# Altium schematic sheet 0190_TOUCH PAD CONNECTO.SchDoc
size 848 x 558 mm
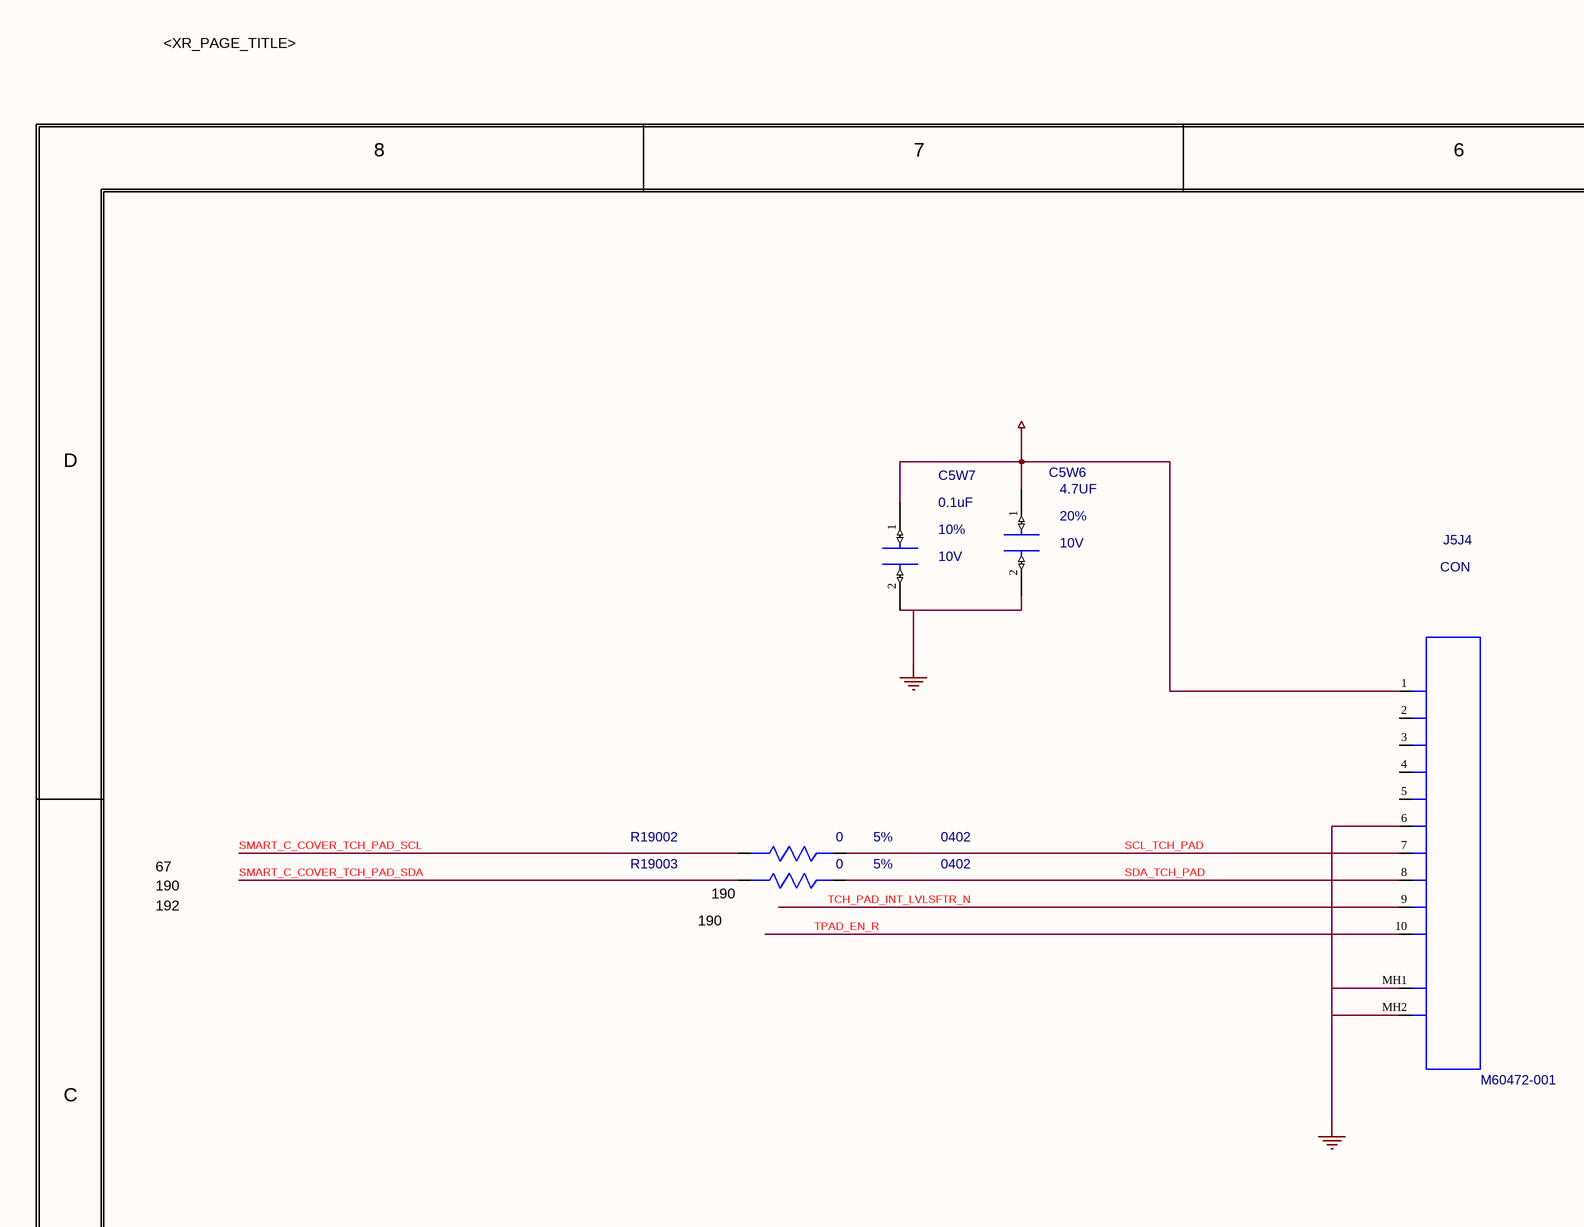
[diagram p0: 0190_TOUCH PAD CONNECTO.SchDoc, top left]
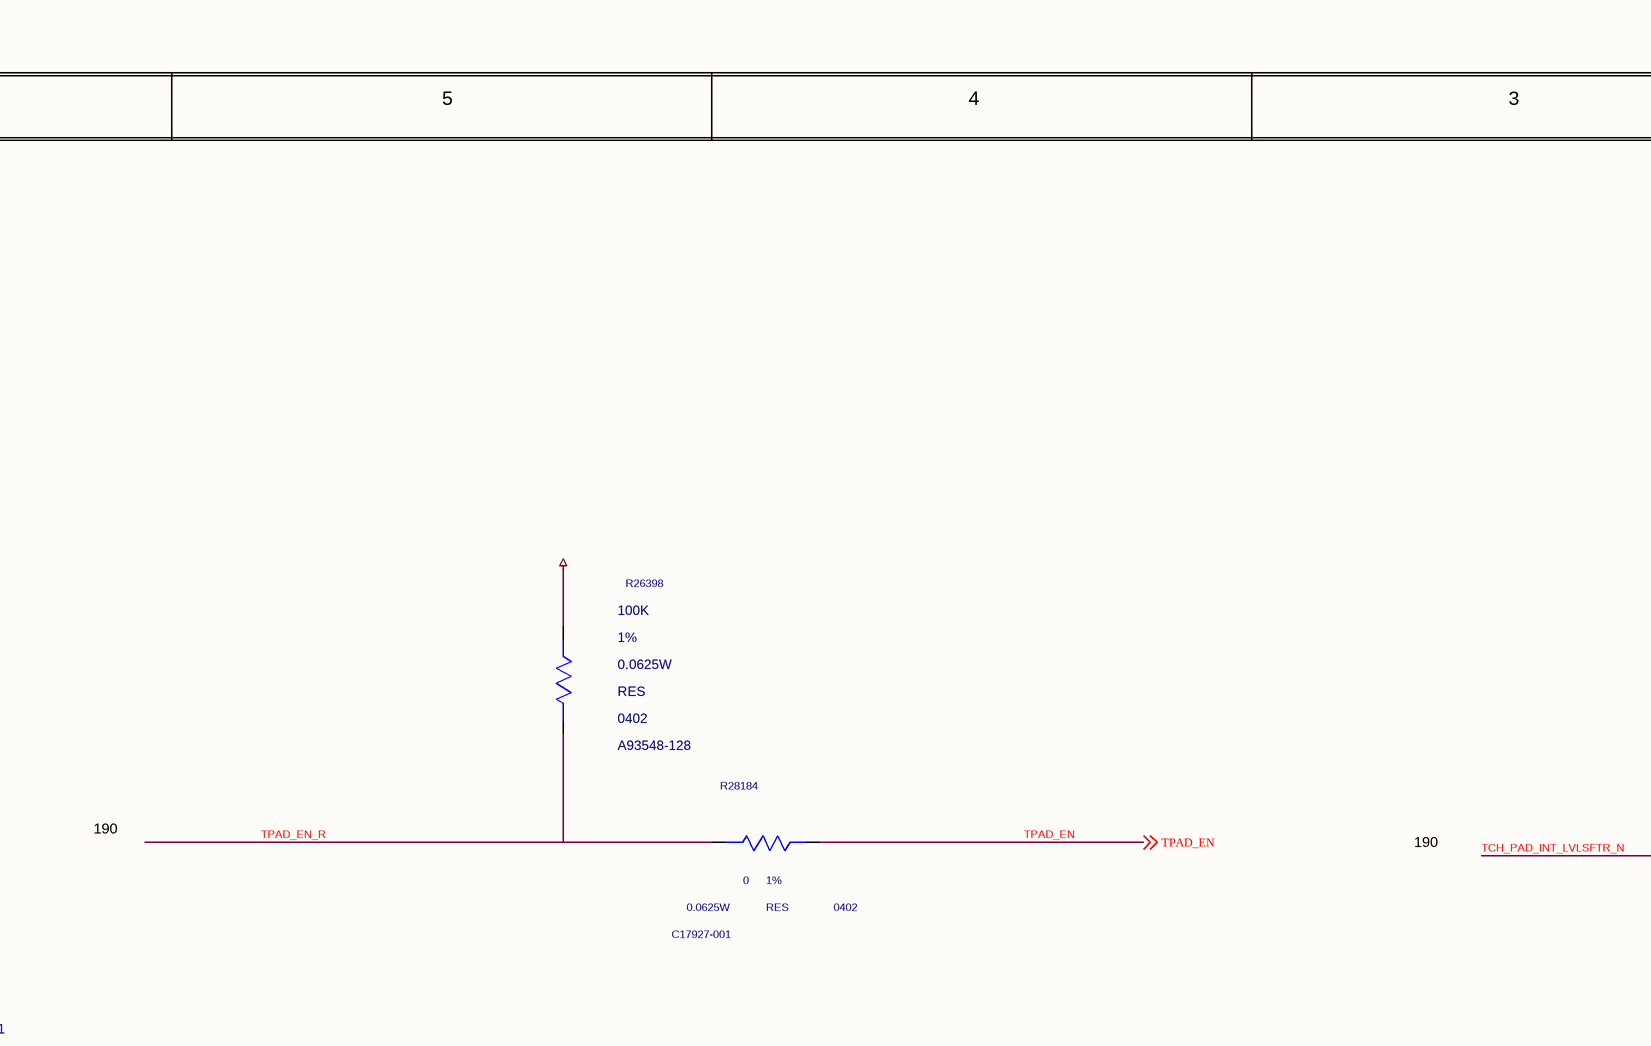
[diagram p1: 0190_TOUCH PAD CONNECTO.SchDoc, top middle]
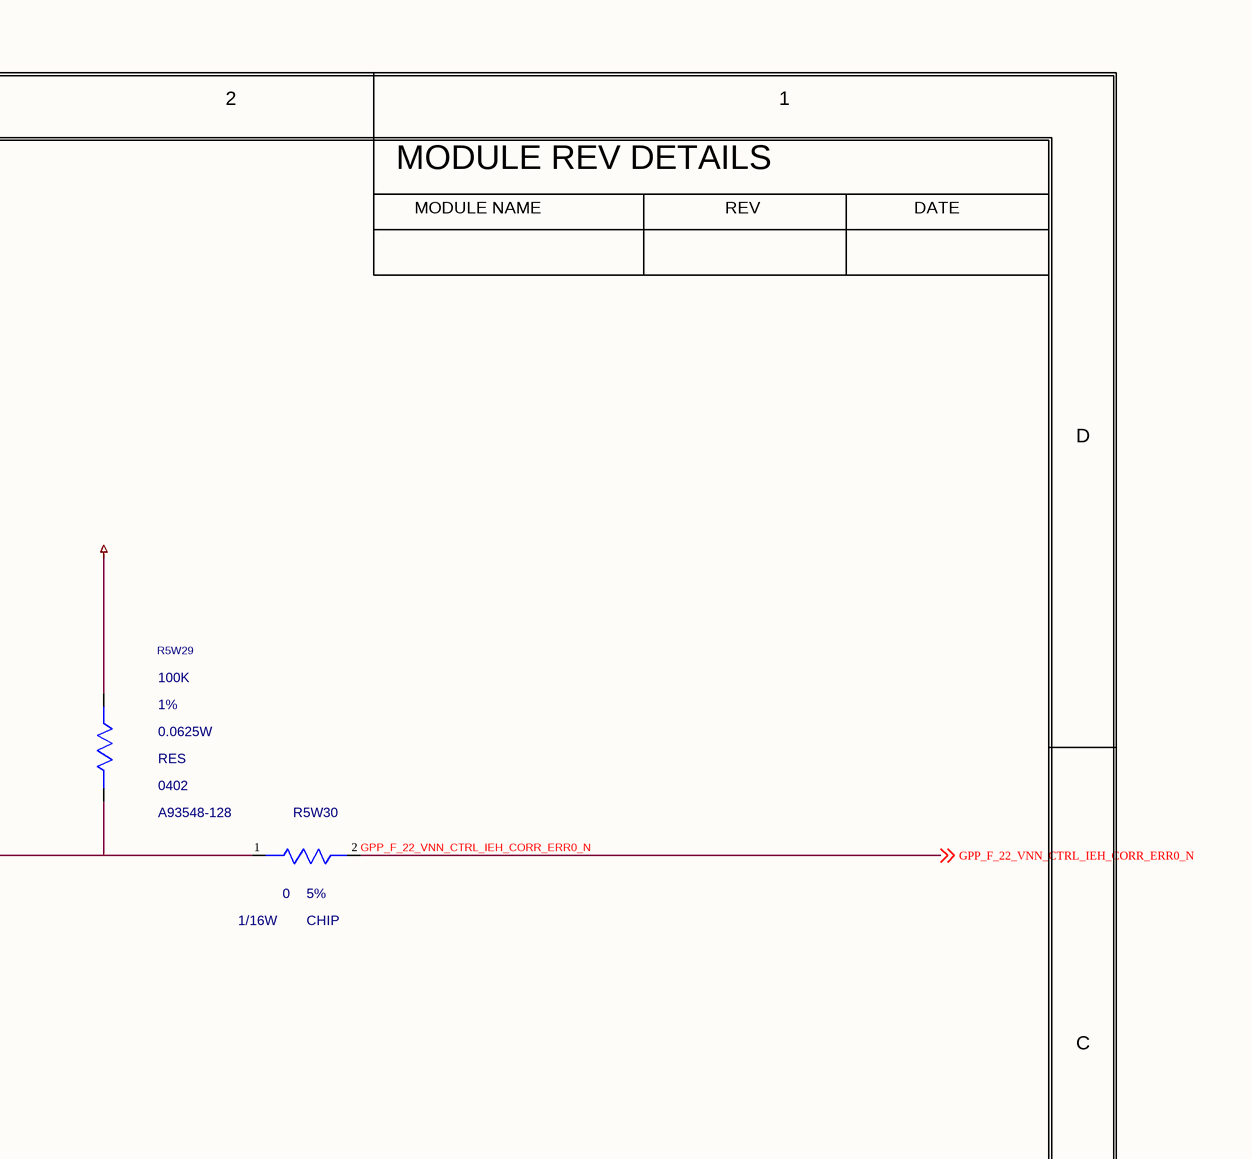
[diagram p2: 0190_TOUCH PAD CONNECTO.SchDoc, top right]
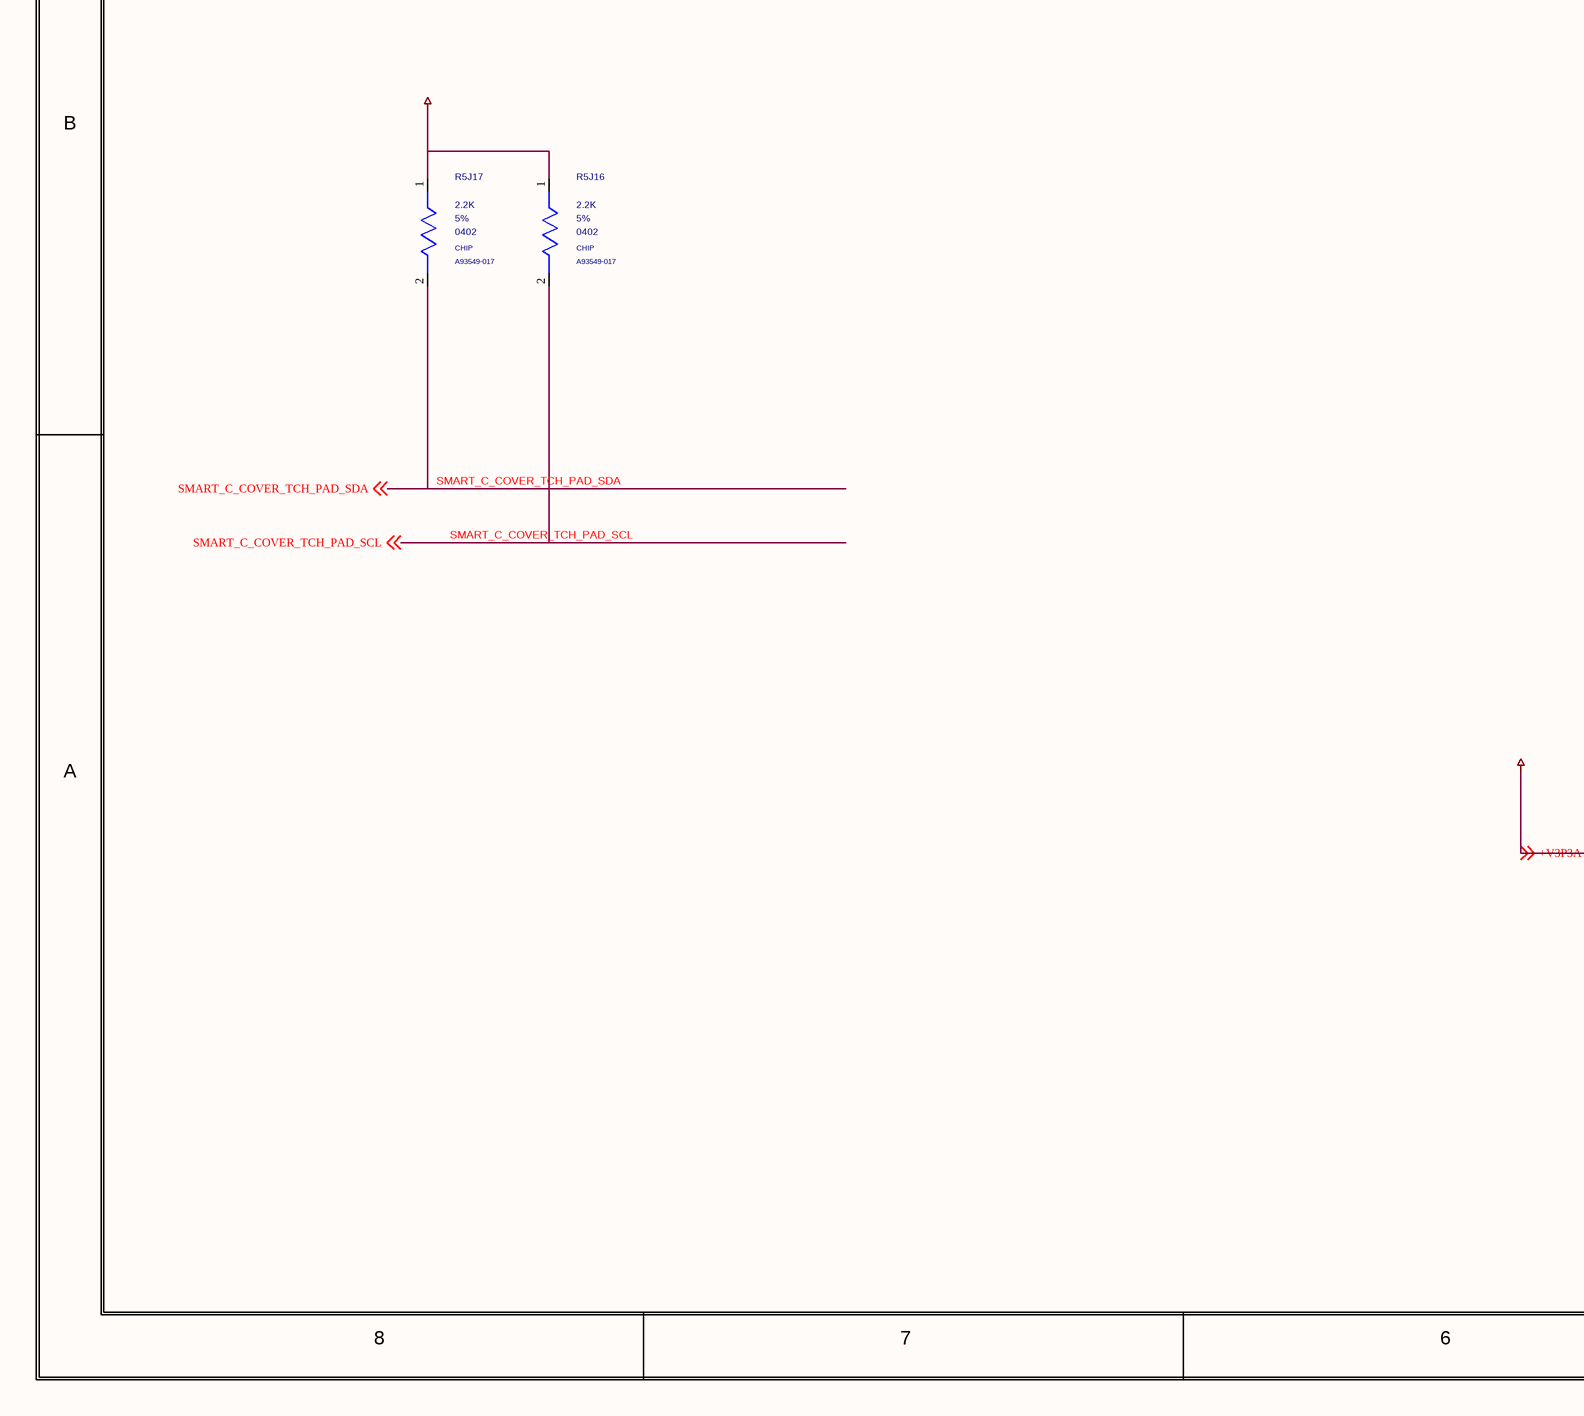
[diagram p3: 0190_TOUCH PAD CONNECTO.SchDoc, bottom left]
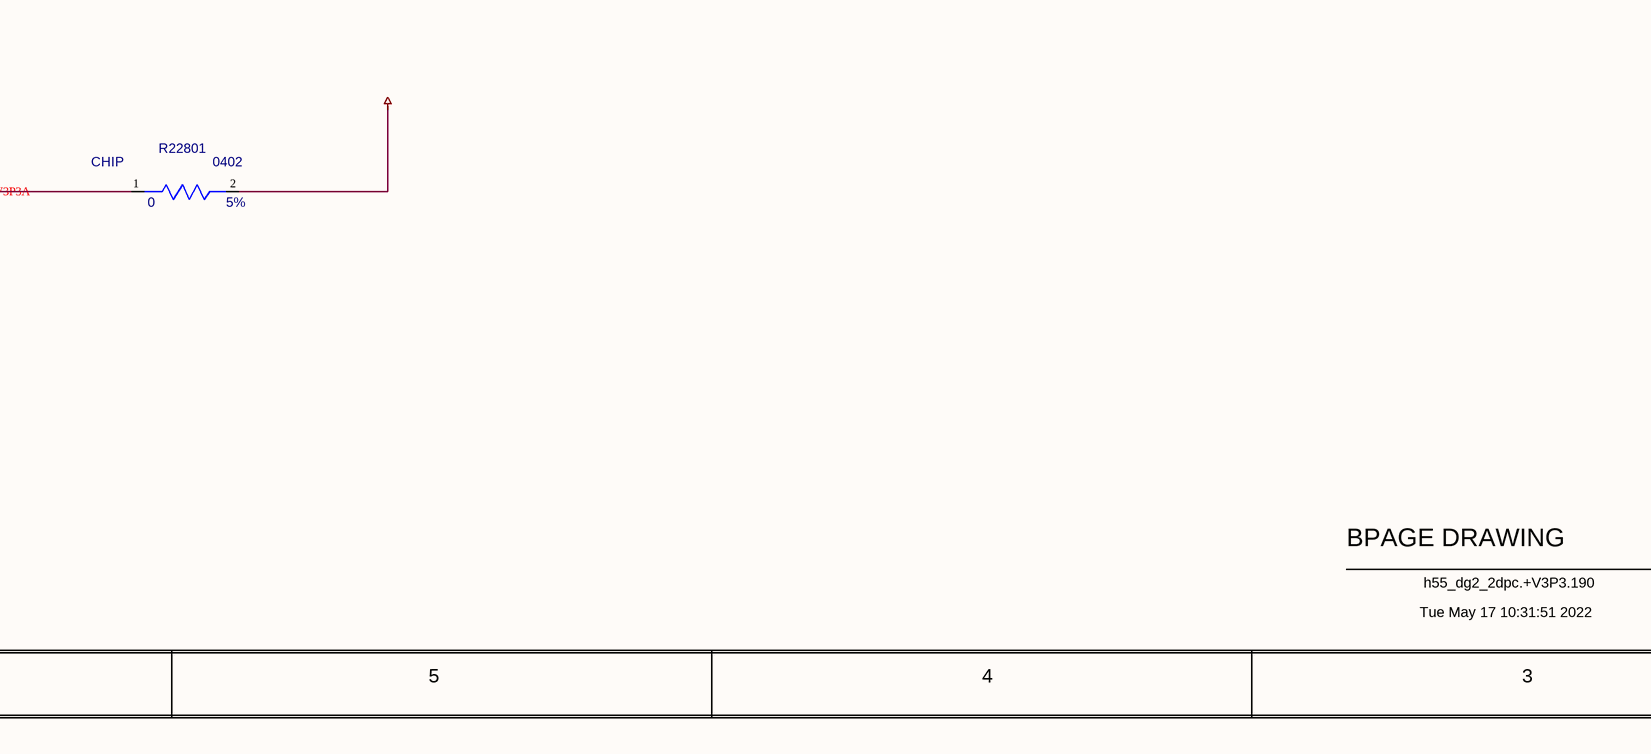
[diagram p4: 0190_TOUCH PAD CONNECTO.SchDoc, bottom middle]
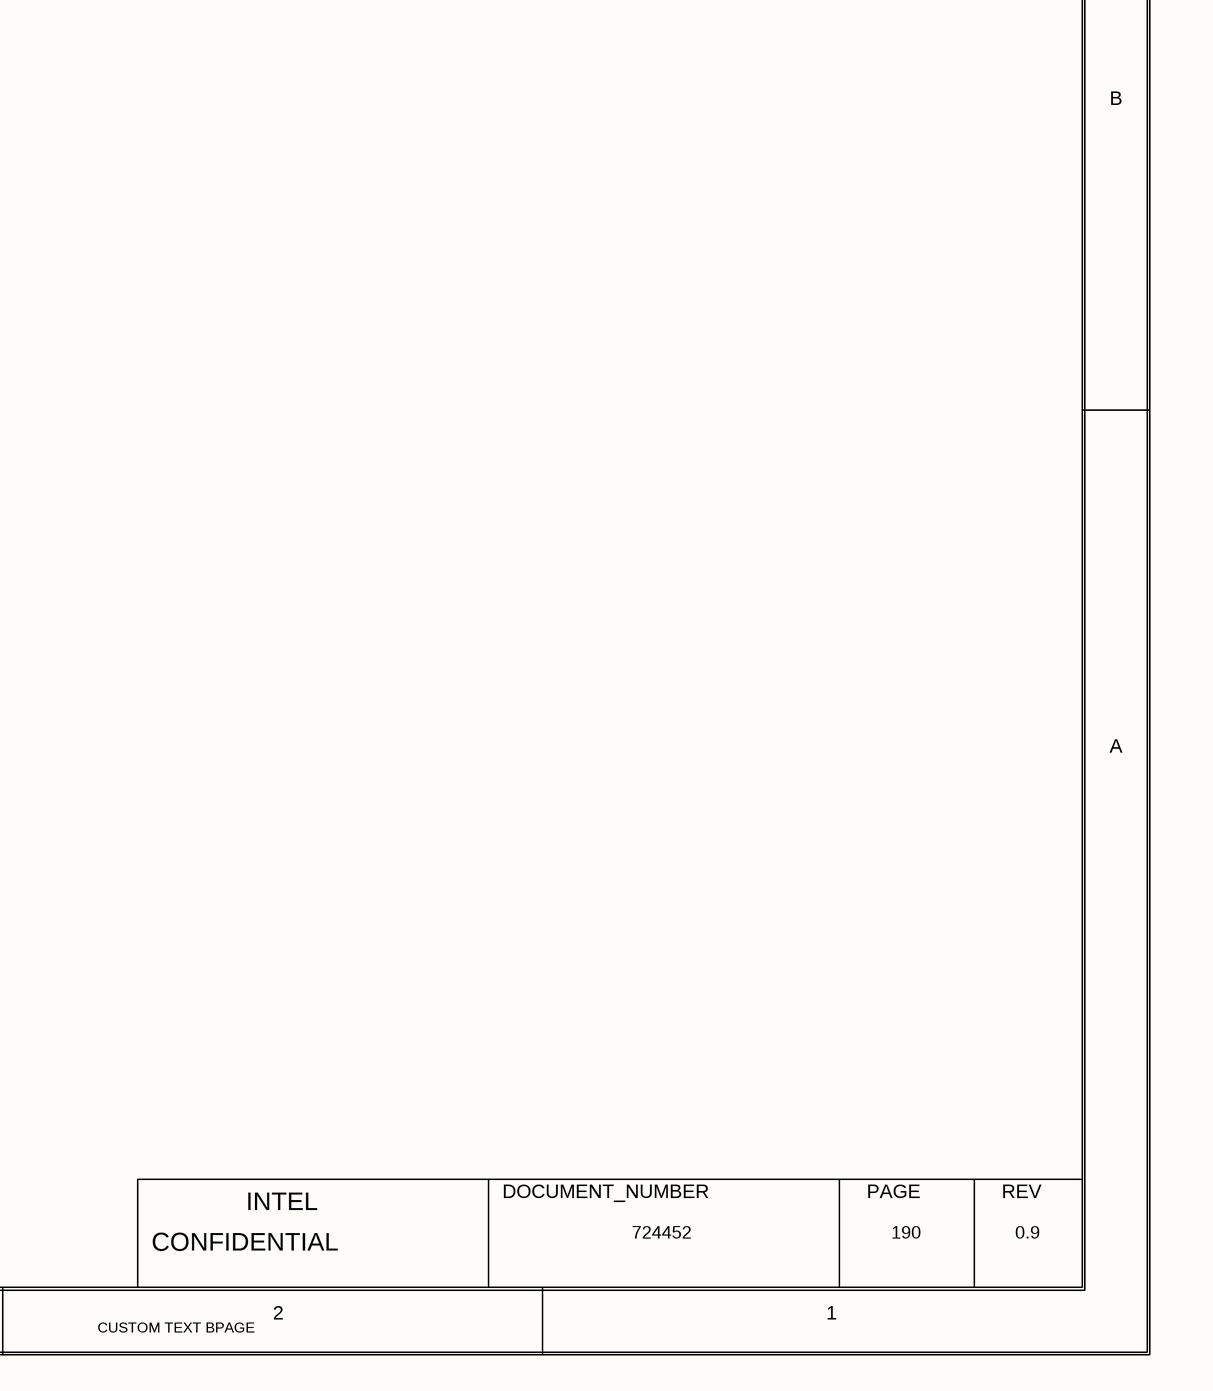
[diagram p5: 0190_TOUCH PAD CONNECTO.SchDoc, bottom right]

## Parts
C5W6  4.7UF  TOLERANCE: 20%  VOLTAGE: 10V  [SMC0402IA]
C5W7  0.1uF  TOLERANCE: 10%  VOLTAGE: 10V  [SMC0402IA]
J5J4  MATERIAL: CON  PART_NUMBER: M60472-001  [CTK0_B2B_SJR_1X10_2EM_500_MD_VR]  (hidden comment: C_B2B_1X10_2EM)
R5J16  2.2K  MATERIAL: CHIP  PACK_TYPE: 0402  PART_NUMBER: A93549-017  TOLERANCE: 5%  [SMR0402IA]
R5J17  2.2K  MATERIAL: CHIP  PACK_TYPE: 0402  PART_NUMBER: A93549-017  TOLERANCE: 5%  [SMR0402IA]
R5W29  100K  MATERIAL: RES  PACK_TYPE: 0402  PART_NUMBER: A93548-128  TOLERANCE: 1%  WATTAGE: 0.0625W  [CTK0_SM0402_1100X550_MA]
R5W30  0  MATERIAL: CHIP  TOLERANCE: 5%  WATTAGE: 1/16W  [SMR0402IA]
R19002  0  PACK_TYPE: 0402  TOLERANCE: 5%  [CTK2_SM0402_1100X550_MA]
R19003  0  PACK_TYPE: 0402  TOLERANCE: 5%  [CTK2_SM0402_1100X550_MA]
R22801  0  MATERIAL: CHIP  PACK_TYPE: 0402  TOLERANCE: 5%  [SMR0402IA]
R26398  100K  MATERIAL: RES  PACK_TYPE: 0402  PART_NUMBER: A93548-128  TOLERANCE: 1%  WATTAGE: 0.0625W  [CTK0_SM0402_1100X550_MA]
R28184  0  MATERIAL: RES  PACK_TYPE: 0402  PART_NUMBER: C17927-001  TOLERANCE: 1%  WATTAGE: 0.0625W  [CTK0_SM0402_1100X550_MA]

## Nets
+V3P3A: R22801.1(A) ; off-sheet +V3P3A
+V3P3A_CLICK_PAD: C5W6.1(A) C5W7.1(A) J5J4.1(IO1) R5J16.1(A) R5J17.1(A) R5W29.1(A) R22801.2(B) R26398.1(A)
GND: C5W6.2(B) C5W7.2(B) J5J4.6(IO6) J5J4.MH1 J5J4.MH2
GPP_F_22_VNN_CTRL_IEH_CORR_ERR0_N: R5W30.2(B) ; off-sheet GPP_F_22_VNN_CTRL_IEH_CORR_ERR0_N
SCL_TCH_PAD: J5J4.7(IO7) R19002.2(B)
SDA_TCH_PAD: J5J4.8(IO8) R19003.2(B)
SMART_C_COVER_TCH_PAD_SCL: R5J16.2(B) R19002.1(A) ; off-sheet SMART_C_COVER_TCH_PAD_SCL
SMART_C_COVER_TCH_PAD_SDA: R5J17.2(B) R19003.1(A) ; off-sheet SMART_C_COVER_TCH_PAD_SDA
TCH_PAD_INT_LVLSFTR_N: J5J4.9(IO9) R5W29.2(B) R5W30.1(A)
TPAD_EN: R28184.2(B) ; off-sheet TPAD_EN
TPAD_EN_R: J5J4.10(IO10) R26398.2(B) R28184.1(A)

Not connected (* = marked no-connect by the designer): J5J4 2(IO2) 3(IO3) 4(IO4) 5(IO5)

## Notes on the sheet
- <XR_PAGE_TITLE>
- 8
- 7
- 6
- 5
- 4
- 3
- 2
- 1
- MODULE REV DETAILS
- MODULE NAME
- REV
- DATE
- D
- 67
- 190
- 192
- (near R19003) 190
- C
- B
- A
- BPAGE DRAWING
- INTEL
- DOCUMENT_NUMBER
- PAGE
- Tue May 17 10:31:51 2022
- h55_dg2_2dpc.+V3P3.190
- CONFIDENTIAL
- 724452
- 0.9
- CUSTOM TEXT BPAGE

## Library data of the parts
C5W6 = CAP: PART_NUMBER: A36096-134; CDS_PHYS_PART_NAME: CAP_0402-A36096-134,X5R,4.7UF,10V,20%,LPDB,GENERIC; MATERIAL: X5R; PACK_TYPE: 0402; OriginalSymbolOrigin: (-50,25); XY: (-5275,4450); VER: 1; ROT: 0; PHYS_PAGE: 190; LOCATION: C5W6; IP: GENERIC; FP_TECH: LPDB; DRAWING: @RVP1_ADL_SB_ADP_S_DDR5_SODIMM_2DPC_LIB.H55_DG2_2DPC(SCH_1):PAGE559; CDS_LIB: discrete; PCB Footprint: SMC0402IA; CHIPS_PART_NAME: CAP; CDS_PART_NAME: CAP_0402-A36096-134,X5R,4.7UF,10V,20%,LPDB,GENERIC; CDS_LOCATION: C5W6
C5W7 = CAP: PART_NUMBER: A36096-043; CDS_PHYS_PART_NAME: CAP_0402-A36096-043,X5R,0.1UF,10V,10%,LPDB,GENERIC; MATERIAL: X5R; PACK_TYPE: 0402; OriginalSymbolOrigin: (-50,25); XY: (-5500,4425); VER: 1; ROT: 0; PHYS_PAGE: 190; LOCATION: C5W7; IP: GENERIC; FP_TECH: LPDB; DRAWING: @RVP1_ADL_SB_ADP_S_DDR5_SODIMM_2DPC_LIB.H55_DG2_2DPC(SCH_1):PAGE559; CDS_LIB: discrete; PCB Footprint: SMC0402IA; CHIPS_PART_NAME: CAP; CDS_PART_NAME: CAP_0402-A36096-043,X5R,0.1UF,10V,10%,LPDB,GENERIC; CDS_LOCATION: C5W7
J5J4 = C_B2B_1X10_2EM: CDS_PHYS_PART_NAME: C_B2B_1X10_2EM_SM-M60472-001,CON,B2B_1X10_2EM,TK0,GENERIC; CDS_LMAN_SYM_OUTLINE: -50,400,50,-400; FP_TECH: TK0; IP: GENERIC; PACK_TYPE: SM; ROOM: NONE; OriginalSymbolOrigin: (-50,400); XY: (-4475,3875); VER: 1; ROT: 2; PHYS_PAGE: 190; LOCATION: J5J4; DRAWING: @RVP1_ADL_SB_ADP_S_DDR5_SODIMM_2DPC_LIB.H55_DG2_2DPC(SCH_1):PAGE559; CDS_LIB: local; VARIANT: ?; PCB Footprint: CTK0_B2B_SJR_1X10_2EM_500_MD_VR; SEC_TYPE: SM; CHIPS_PART_NAME: C_B2B_1X10_2EM; CDS_PART_NAME: C_B2B_1X10_2EM_SM-M60472-001,CON,B2B_1X10_2EM,TK0,GENERIC; CDS_LOCATION: J5J4
R5J16 = RES: CDS_PHYS_PART_NAME: RES_0402-A93549-017,CHIP,2.2K,5%,1/16W,LPDB,GENERIC; WATTAGE: 1/16W; OriginalSymbolOrigin: (-25,75); XY: (-6150,2100); VER: 2; ROT: 0; PHYS_PAGE: 190; LOCATION: R5J16; IP: GENERIC; FP_TECH: LPDB; FIN: PCH; DRAWING: @RVP1_ADL_SB_ADP_S_DDR5_SODIMM_2DPC_LIB.H55_DG2_2DPC(SCH_1):PAGE559; CDS_LIB: discrete; PCB Footprint: SMR0402IA; CHIPS_PART_NAME: RES; CDS_PART_NAME: RES_0402-A93549-017,CHIP,2.2K,5%,1/16W,LPDB,GENERIC; CDS_LOCATION: R5J16; ASI_MODEL: A93549-017
R5J17 = RES: CDS_PHYS_PART_NAME: RES_0402-A93549-017,CHIP,2.2K,5%,1/16W,LPDB,GENERIC; WATTAGE: 1/16W; OriginalSymbolOrigin: (-25,75); XY: (-6375,2100); VER: 2; ROT: 0; PHYS_PAGE: 190; LOCATION: R5J17; IP: GENERIC; FP_TECH: LPDB; FIN: PCH; DRAWING: @RVP1_ADL_SB_ADP_S_DDR5_SODIMM_2DPC_LIB.H55_DG2_2DPC(SCH_1):PAGE559; CDS_LIB: discrete; PCB Footprint: SMR0402IA; CHIPS_PART_NAME: RES; CDS_PART_NAME: RES_0402-A93549-017,CHIP,2.2K,5%,1/16W,LPDB,GENERIC; CDS_LOCATION: R5J17; ASI_MODEL: A93549-017
R5W29 = C_RES: CDS_PHYS_PART_NAME: C_RES_0402-A93548-128,RES,100K,1%,0.0625W,TK0,GENERIC; CDS_LMAN_SYM_OUTLINE: -50,50,50,-50; FP_TECH: TK0; IP: GENERIC; ROOM: NONE; OriginalSymbolOrigin: (-25,75); XY: (-725,3975); VER: 2; SUB_ROOM_2: PUPD; SUB_ROOM_1: CLICK PAD; ROT: 0; PHYS_PAGE: 190; LOCATION: R5W29; DRAWING: @RVP1_ADL_SB_ADP_S_DDR5_SODIMM_2DPC_LIB.H55_DG2_2DPC(SCH_1):PAGE559; CDS_LIB: c_discrete; VARIANT: ?; PCB Footprint: CTK0_SM0402_1100X550_MA; SUB_ROOM: PUPD; SEC_TYPE: 0402; CHIPS_PART_NAME: C_RES; CDS_PART_NAME: C_RES_0402-A93548-128,RES,100K,1%,0.0625W,TK0,GENERIC; CDS_LOCATION: R5W29
R5W30 = RES#1: PART_NUMBER: A93549-001; CHIPS_PART_NAME: RES; CDS_PHYS_PART_NAME: RES_0402-A93549-001,CHIP,0,5%,1/16W,LPDB,GENERIC; PACK_TYPE: 0402; OriginalSymbolOrigin: (-75,25); XY: (-350,3775); VER: 1; PHYS_PAGE: 190; LOCATION: R5W30; IP: GENERIC; FP_TECH: LPDB; DRAWING: @RVP1_ADL_SB_ADP_S_DDR5_SODIMM_2DPC_LIB.H55_DG2_2DPC(SCH_1):PAGE559; CDS_LIB: discrete; PCB Footprint: SMR0402IA; ROT: 0; CDS_PART_NAME: RES_0402-A93549-001,CHIP,0,5%,1/16W,LPDB,GENERIC; CDS_LOCATION: R5W30
R19002 = C_RES#1: PART_NUMBER: C75811-002; CHIPS_PART_NAME: C_RES; CDS_PHYS_PART_NAME: C_RES_0402-C75811-002,RES,0,5%,0.0625W,TK2,GENERIC; CDS_LMAN_SYM_OUTLINE: -50,50,50,-50; FP_TECH: TK2; IP: GENERIC; ROOM: NONE; WATTAGE: 0.0625W; OriginalSymbolOrigin: (-75,25); XY: (-5700,3875); VER: 1; PHYS_PAGE: 190; LOCATION: R19002; DRAWING: @RVP1_ADL_SB_ADP_S_DDR5_SODIMM_2DPC_LIB.H55_DG2_2DPC(SCH_1):PAGE559; CDS_LIB: c_discrete; MATERIAL: RES; VARIANT: ?; PCB Footprint: CTK2_SM0402_1100X550_MA; ROT: 0; CDS_PART_NAME: C_RES_0402-C75811-002,RES,0,5%,0.0625W,TK2,GENERIC; CDS_LOCATION: R19002
R19003 = C_RES#1: PART_NUMBER: C75811-002; CHIPS_PART_NAME: C_RES; CDS_PHYS_PART_NAME: C_RES_0402-C75811-002,RES,0,5%,0.0625W,TK2,GENERIC; CDS_LMAN_SYM_OUTLINE: -50,50,50,-50; FP_TECH: TK2; IP: GENERIC; ROOM: NONE; WATTAGE: 0.0625W; OriginalSymbolOrigin: (-75,25); XY: (-5700,3825); VER: 1; PHYS_PAGE: 190; LOCATION: R19003; DRAWING: @RVP1_ADL_SB_ADP_S_DDR5_SODIMM_2DPC_LIB.H55_DG2_2DPC(SCH_1):PAGE559; CDS_LIB: c_discrete; MATERIAL: RES; VARIANT: ?; PCB Footprint: CTK2_SM0402_1100X550_MA; ROT: 0; CDS_PART_NAME: C_RES_0402-C75811-002,RES,0,5%,0.0625W,TK2,GENERIC; CDS_LOCATION: R19003
R22801 = RES#1: PART_NUMBER: A93549-001; CHIPS_PART_NAME: RES; CDS_PHYS_PART_NAME: RES_0402-A93549-001,CHIP,0,5%,1/16W,LPDB,GENERIC; WATTAGE: 1/16W; OriginalSymbolOrigin: (-75,25); XY: (-3950,950); VER: 1; PHYS_PAGE: 190; LOCATION: R22801; IP: GENERIC; FP_TECH: LPDB; DRAWING: @RVP1_ADL_SB_ADP_S_DDR5_SODIMM_2DPC_LIB.H55_DG2_2DPC(SCH_1):PAGE559; CDS_LIB: discrete; PCB Footprint: SMR0402IA; ROT: 0; CDS_PART_NAME: RES_0402-A93549-001,CHIP,0,5%,1/16W,LPDB,GENERIC; CDS_LOCATION: R22801
R26398 = C_RES: CDS_PHYS_PART_NAME: C_RES_0402-A93548-128,RES,100K,1%,0.0625W,TK0,GENERIC; CDS_LMAN_SYM_OUTLINE: -50,50,50,-50; FP_TECH: TK0; IP: GENERIC; ROOM: NONE; OriginalSymbolOrigin: (-25,75); XY: (-3250,4100); VER: 2; SUB_ROOM_2: PUPD; SUB_ROOM_1: CLICK PAD; ROT: 0; PHYS_PAGE: 190; LOCATION: R26398; DRAWING: @RVP1_ADL_SB_ADP_S_DDR5_SODIMM_2DPC_LIB.H55_DG2_2DPC(SCH_1):PAGE559; CDS_LIB: c_discrete; VARIANT: ?; PCB Footprint: CTK0_SM0402_1100X550_MA; SUB_ROOM: PUPD; CHIPS_PART_NAME: C_RES; CDS_PART_NAME: C_RES_0402-A93548-128,RES,100K,1%,0.0625W,TK0,GENERIC; CDS_LOCATION: R26398
R28184 = C_RES#1: CHIPS_PART_NAME: C_RES; CDS_PHYS_PART_NAME: C_RES_0402-C17927-001,RES,0,1%,0.0625W,TK0,GENERIC; CDS_LMAN_SYM_OUTLINE: -50,50,50,-50; FP_TECH: TK0; IP: GENERIC; ROOM: NONE; OriginalSymbolOrigin: (-75,25); XY: (-2875,3800); VER: 1; PHYS_PAGE: 190; LOCATION: R28184; DRAWING: @RVP1_ADL_SB_ADP_S_DDR5_SODIMM_2DPC_LIB.H55_DG2_2DPC(SCH_1):PAGE559; CDS_LIB: c_discrete; VARIANT: ?; PCB Footprint: CTK0_SM0402_1100X550_MA; SEC_TYPE: 0402; ROT: 0; CDS_PART_NAME: C_RES_0402-C17927-001,RES,0,1%,0.0625W,TK0,GENERIC; CDS_LOCATION: R28184